# EAGLE design PDL (EAGLE 5.11)
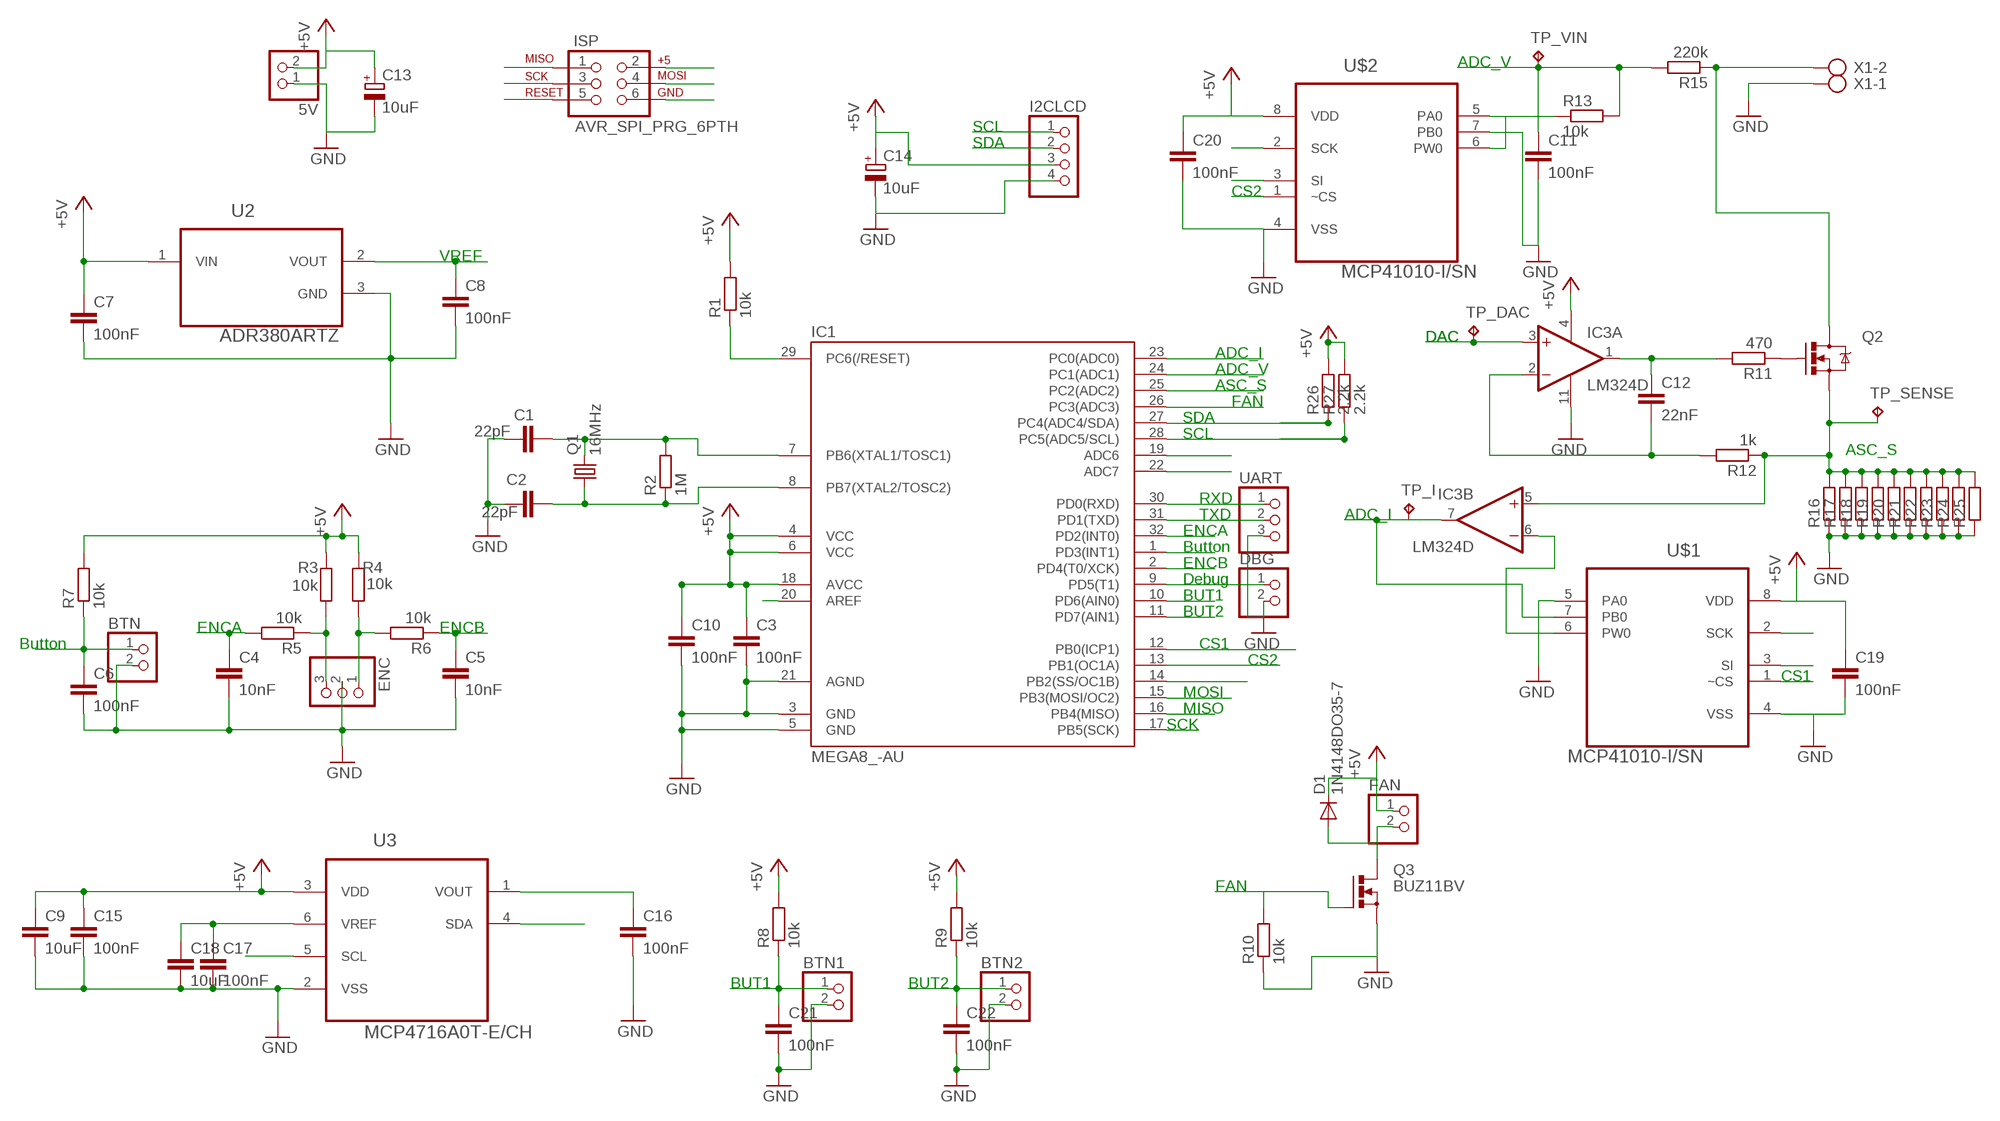
[diagram p0: schematic, sheet 1]

## Parts
5V  PINHD-1X2  [1X02]
BTN  PINHD-1X2  [1X02]
BTN1  PINHD-1X2  [1X02]
BTN2  PINHD-1X2  [1X02]
C1  22pF  C-EUC0805  [C0805]
C2  22pF  C-EUC0805  [C0805]
C3  100nF  C-EUC0805  [C0805]
C4  10nF  C-EUC0805  [C0805]
C5  10nF  C-EUC0805  [C0805]
C6  100nF  C-EUC0805  [C0805]
C7  100nF  C-EUC0805  [C0805]
C8  100nF  C-EUC0805  [C0805]
C9  10uF  C-EUC0805  [C0805]
C10  100nF  C-EUC0805  [C0805]
C11  100nF  C-EUC0805  [C0805]
C12  22nF  C-EUC0805  [C0805]
C13  10uF  CPOL-EU153CLV-0405  [153CLV-0405]
C14  10uF  CPOL-EU153CLV-0405  [153CLV-0405]
C15  100nF  C-EUC0805  [C0805]
C16  100nF  C-EUC0805  [C0805]
C17  100nF  C-EUC0805  [C0805]
C18  10uF  C-EUC0805  [C0805]
C19  100nF  C-EUC0805  [C0805]
C20  100nF  C-EUC0805  [C0805]
C21  100nF  C-EUC0805  [C0805]
C22  100nF  C-EUC0805  [C0805]
D1  1N4148DO35-7  [DO35-7]
DBG  PINHD-1X2  [1X02]
ENC  PINHD-1X3  [1X03]
FAN  PINHD-1X2  [1X02]
I2CLCD  PINHD-1X4  [1X04]
IC1  MEGA8_-AU  [TQFP32-08]
IC3  LM324D  [SO14]
ISP  AVR_SPI_PRG_6PTH  [2X3]
Q1  16MHz  CRYSTALHC49S  [HC49/S]
Q2  MOSFET-NCHANNELPTH2  [TO220V]
Q3  BUZ11BV  [TO220BV]
R1  10k  R-EU_R0805  [R0805]
R2  1M  R-EU_R0805  [R0805]
R3  10k  R-EU_R0805  [R0805]
R4  10k  R-EU_R0805  [R0805]
R5  10k  R-EU_R0805  [R0805]
R6  10k  R-EU_R0805  [R0805]
R7  10k  R-EU_R0805  [R0805]
R8  10k  R-EU_R0805  [R0805]
R9  10k  R-EU_R0805  [R0805]
R10  10k  R-EU_R0805  [R0805]
R11  470  R-EU_R0805  [R0805]
R12  1k  R-EU_R0805  [R0805]
R13  10k  R-EU_R0805  [R0805]
R15  220k  R-EU_R0805  [R0805]
R16  R-EU_0309/12  [0309/12]
R17  R-EU_0309/12  [0309/12]
R18  R-EU_0309/12  [0309/12]
R19  R-EU_0309/12  [0309/12]
R20  R-EU_0309/12  [0309/12]
R21  R-EU_0309/12  [0309/12]
R22  R-EU_0309/12  [0309/12]
R23  R-EU_0309/12  [0309/12]
R24  R-EU_0309/12  [0309/12]
R25  R-EU_0309/12  [0309/12]
R26  2.2k  R-EU_R0805  [R0805]
R27  2.2k  R-EU_R0805  [R0805]
TP_DAC  TPTP20SQ  [TP20SQ]
TP_I  TPTP20SQ  [TP20SQ]
TP_SENSE  TPTP20SQ  [TP20SQ]
TP_VIN  TPTP20SQ  [TP20SQ]
U2  ADR380ARTZ  [SOT95P237X112-3N]
U3  MCP4716A0T-E/CH  [SOT95P270X145-6N]
U$1  MCP41010-I/SN  [SOIC127P600X175-8N]
U$2  MCP41010-I/SN  [SOIC127P600X175-8N]
UART  PINHD-1X3  [1X03]
X1  AK500/2  [AK500/2]

## Nets
+5V: 5V.2 C3.1 C7.1 C9.1 C10.1 C13.+ C14.+ C15.1 C19.1 C20.1 D1.C FAN.1 I2CLCD.3 IC1.4(VCC) IC1.6(VCC) IC1.18(AVCC) IC3.4(P:V+) ISP.2 R1.2 R3.2 R4.2 R7.2 R8.2 R9.2 R26.2 R27.2 U2.1(VIN) U3.3(VDD) U$1.8(VDD) U$2.8(VDD)
ADC_I: IC1.23(PC0(ADC0)) IC3.7(B:OUT) TP_I.TP U$1.7(PB0)
ADC_S: IC1.25(PC2(ADC2)) IC3.5(B:+IN) Q2.3(S) R12.1 R16.2 R17.2 R18.2 R19.2 R20.2 R21.2 R22.2 R23.2 R24.2 R25.2 TP_SENSE.TP
ADC_V: C11.1 IC1.24(PC1(ADC1)) R13.2 R15.2 TP_VIN.TP
BTN: BTN.1 C6.1 IC1.1(PD3(INT1)) R7.1
BUT1: BTN1.1 C21.1 IC1.10(PD6(AIN0)) R8.1
BUT2: BTN2.1 C22.1 IC1.11(PD7(AIN1)) R9.1
CS1: IC1.12(PB0(ICP1)) U$1.1(~CS)
CS2: IC1.13(PB1(OC1A)) U$2.1(~CS)
DAC: C16.1 IC3.3(A:+IN) TP_DAC.TP U3.1(VOUT)
DAC_CS: IC1.14(PB2(SS/OC1B))
ENCA: C4.1 IC1.32(PD2(INT0)) R5.2
ENCB: C5.1 IC1.2(PD4(T0/XCK)) R6.1
FAN: IC1.26(PC3(ADC3)) Q3.G R10.2
GND: 5V.1 BTN1.2 BTN2.2 BTN.2 C1.2 C2.1 C3.2 C4.2 C5.2 C6.2 C7.2 C8.2 C9.2 C10.2 C11.2 C13.- C14.- C15.2 C16.2 C17.2 C18.2 C19.2 C20.2 C21.2 C22.2 DBG.2 ENC.2 I2CLCD.4 IC1.3(GND) IC1.5(GND) IC1.21(AGND) IC3.11(P:V-) ISP.6 Q3.S R10.1 R16.1 R17.1 R18.1 R19.1 R20.1 R21.1 R22.1 R23.1 R24.1 R25.1 U2.3(GND) U3.2(VSS) U$1.4(VSS) U$1.5(PA0) U$2.4(VSS) U$2.7(PB0) UART.3 X1.1
MISO: IC1.16(PB4(MISO)) ISP.1
MOSI: IC1.15(PB3(MOSI/OC2)) ISP.4 U$1.3(SI) U$2.3(SI)
N$1: C12.2 IC3.2(A:-IN) R12.2
N$2: C12.1 IC3.1(A:OUT) R11.2
N$3: ENC.3 R3.1 R5.1
N$4: Q2.2(D) R15.1 X1.2
N$6: R13.1 U$2.5(PA0) U$2.6(PW0)
N$7: IC3.6(B:-IN) U$1.6(PW0)
N$9: DBG.1 IC1.9(PD5(T1))
N$11: C1.1 IC1.7(PB6(XTAL1/TOSC1)) Q1.2 R2.2
N$12: C2.2 IC1.8(PB7(XTAL2/TOSC2)) Q1.1 R2.1
N$13: ENC.1 R4.1 R6.2
N$16: Q2.1(G) R11.1
N$18: IC1.30(PD0(RXD)) UART.1
N$19: IC1.31(PD1(TXD)) UART.2
N$20: IC1.19(ADC6)
N$21: IC1.22(ADC7)
N$23: D1.A FAN.2 Q3.D
RST: IC1.29(PC6(/RESET)) ISP.5 R1.1
SCK: IC1.17(PB5(SCK)) ISP.3 U$1.2(SCK) U$2.2(SCK)
SCL: I2CLCD.1 IC1.28(PC5(ADC5/SCL)) R27.1 U3.5(SCL)
SDA: I2CLCD.2 IC1.27(PC4(ADC4/SDA)) R26.1 U3.4(SDA)
VREF: C8.1 C17.1 C18.1 IC1.20(AREF) U2.2(VOUT) U3.6(VREF)
Unconnected: IC3.8(C:OUT) IC3.9(C:-IN) IC3.10(C:+IN) IC3.12(D:+IN) IC3.13(D:-IN) IC3.14(D:OUT)

## Notes on the sheet
- ADC_V
- SCL
- SDA
- CS2
- VREF
- DAC | DAC
- ADC_I
- ADC_V
- ASC_S
- FAN
- SDA
- SCL
- ASC_S
- RXD
- TXD | ADC_I
- ENCA
- Button
- ENCB
- Debug
- BUT1
- BUT2
- ENCA | ENCB
- Button | CS1
- CS2
- CS1
- MOSI
- MISO
- SCK
- FAN
- BUT1 | BUT2

## Library data of the parts
5V BTN BTN1 BTN2 DBG FAN = pinhead:PINHD-1X2: PIN HEADER
C1-C12 C15-C22 = rcl:C-EU: CAPACITOR, European symbol
C13 C14 = rcl:CPOL-EU: POLARIZED CAPACITOR, European symbol
D1 = diode:1N4148: DIODE high speed (Philips)
ENC UART = pinhead:PINHD-1X3: PIN HEADER
I2CLCD = pinhead:PINHD-1X4: PIN HEADER
IC1 = avr-7:MEGA8_
IC3 = linear:LM324: OP AMP
ISP = SparkFun:AVR_SPI_PRG_6: AVR ISP 6 Pin This is the reduced ISP connector for AVR programming. Common on Arduino. This footprint will take up less PCB space and can be used with a 10-pin to 6-pin adapter such as SKU: BOB-08508
Q1 = crystal:CRYSTAL: CRYSTAL; OC_FARNELL: 1667008; OC_NEWARK: unknown
Q2 = SparkFun:MOSFET-NCHANNEL
Q3 = transistor-power:BUZ11: N-CHANNEL MOS FET
R1-R13 R15-R27 = rcl:R-EU_: RESISTOR, European symbol
TP_DAC TP_I TP_SENSE TP_VIN = testpad:TP: Test pad
U2 = ADR380:ADR380ARTZ: IC Precision Low Drift 2.048 V/2.500 V SOT-23 Voltage Reference; MPN: ADR380ARTZ; OC_FARNELL: ADR380ARTZ; OC_NEWARK: 73T8170; PACKAGE: SOT-23-3; SUPPLIER: Analog Devices
U3 = MCP4716:MCP4716A0T-E/CH: Digital-to-Analog Converter,SOT23- 6; MPN: MCP4716A0T-E/CH; OC_FARNELL: 1925045; OC_NEWARK: 58T2010; PACKAGE: SOT23- 6; SUPPLIER: MICROCHIP
U$1 U$2 = MCP41xxx:MCP41010-I/SN: Digital potentiometer; DESCRIPTION: Digital potentiometer; MPN: MCP41010-I/SN; OC_FARNELL: 9758607; OC_NEWARK: 61K2949; PACKAGE: SOIC-8; SUPPLIER: Microchip
X1 = con-ptr500:AK500/2: CONNECTOR; OC_FARNELL: unknown; OC_NEWARK: unknown

## Board
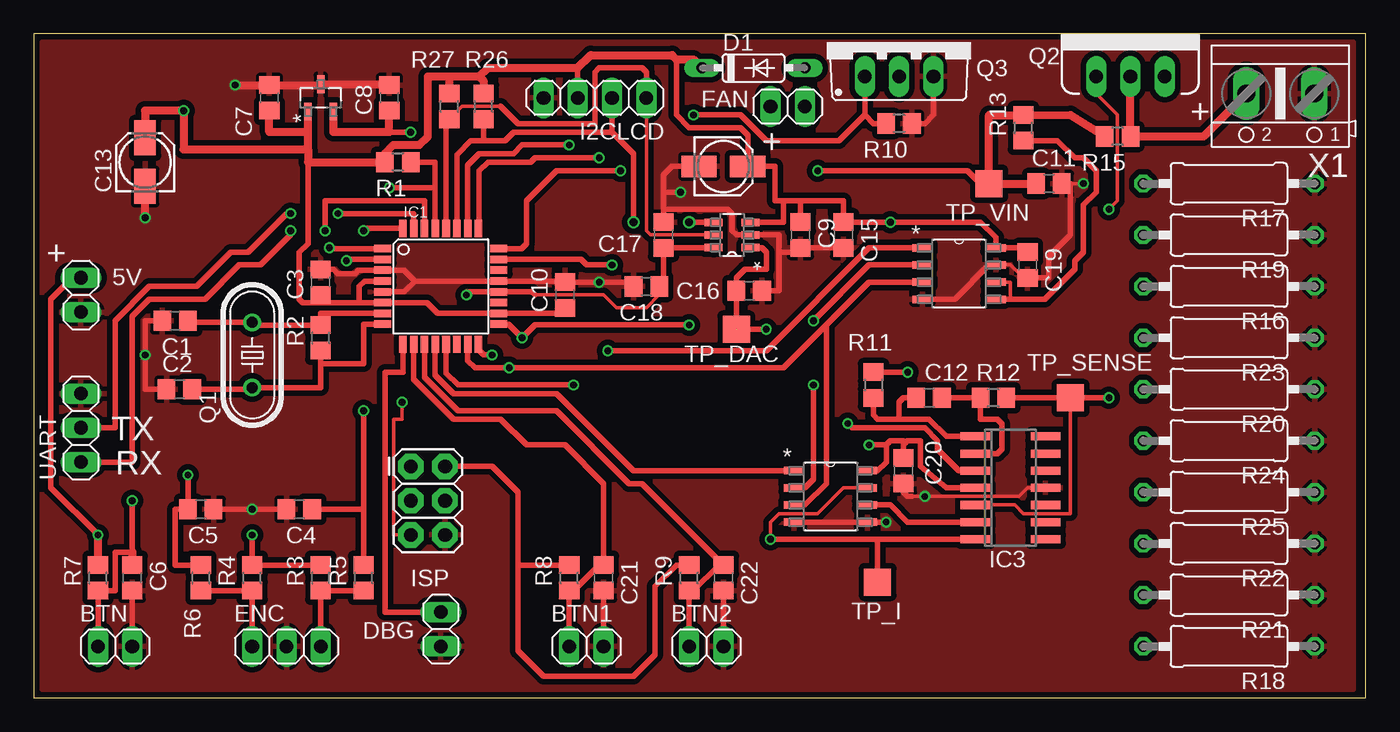
[diagram p1: board, top side]
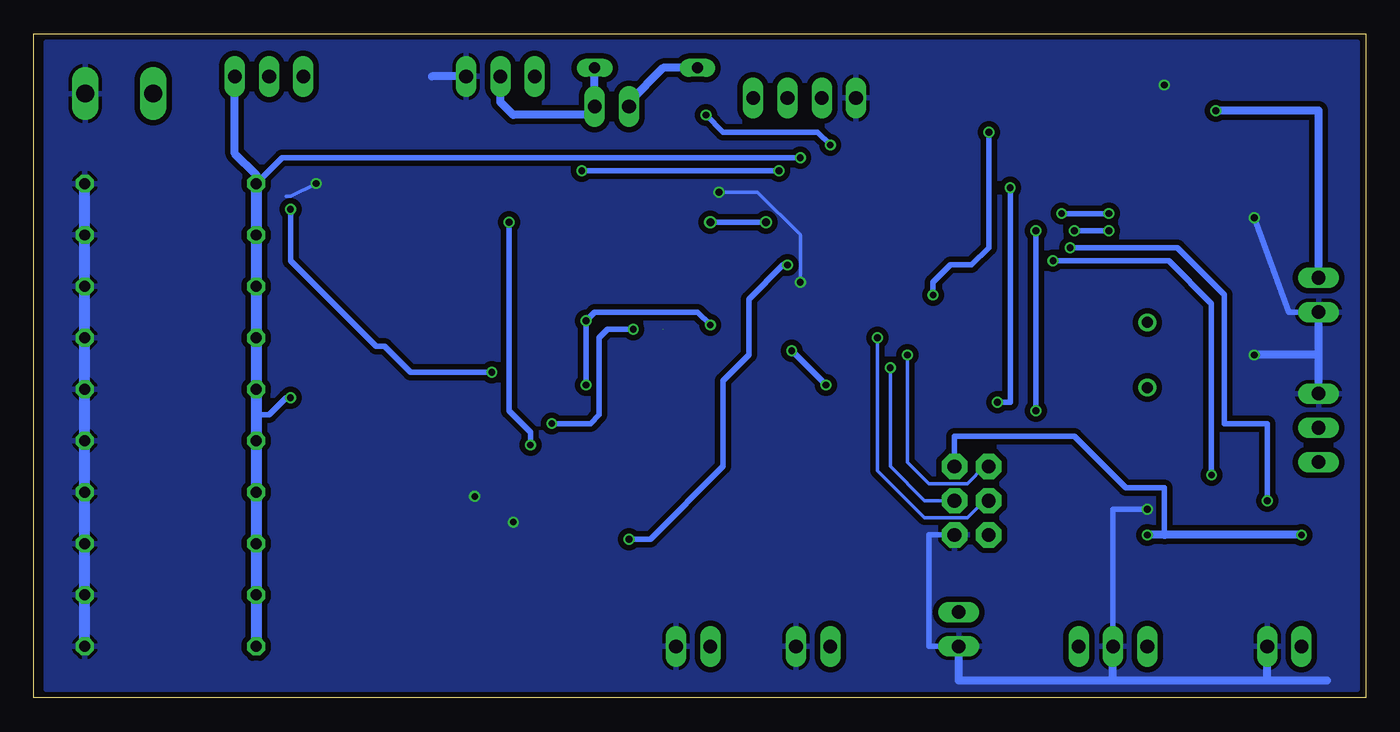
[diagram p2: board, bottom side, seen from below]

Size 98.72 x 49.2 mm. Coordinates in mm from the lower left corner, seen from the top.
Outline: 0,0 98.72,0 98.72,49.2 0,49.2 0,0
Copper layers (1*16): Top 0.035mm / dielectric 1.5mm / Bottom 0.035mm
Design rules "SeeedStudio_2layer_DRU_no_angle_20140221": minimum track width 6mil, minimum drill 12mil, track to track 6mil, track to pad 6mil, pad to pad 6mil, via to via 6mil, smd to smd 0mil, copper to edge 10mil, drill to drill 10mil, minimum pad ring 10mil, minimum via ring 6mil, stop-mask expansion 2mil, vias tented up to drill 100mil, thermal gap 10mil

### Footprints (pad centres in the part's own frame; a part is rotated, then mirrored left to right if it is on the bottom)
1X02 = drill 1.016 long: 1 -1.27,0; 2 1.27,0
C0805 = smd 1.3 x 1.5: 1 -0.95,0; 2 0.95,0
153CLV-0405 = smd 2.6 x 1.6: + 1.8,0; - -1.8,0
DO35-7 = drill 0.813 long: A 3.81,0; C -3.81,0
1X03 = drill 1.016 long: 1 -2.54,0; 2 0,0; 3 2.54,0
1X04 = drill 1.016 long: 1 -3.81,0; 2 -1.27,0; 3 1.27,0; 4 3.81,0
TQFP32-08 = smd 1.27 x 0.559: 1 -4.293,2.8; 2 -4.293,2; 3 -4.293,1.2; 4 -4.293,0.4; 5 -4.293,-0.4; 6 -4.293,-1.2; 7 -4.293,-2; 8 -4.293,-2.8; 17 4.293,-2.8; 18 4.293,-2; 19 4.293,-1.2; 20 4.293,-0.4; 21 4.293,0.4; 22 4.293,1.2; 23 4.293,2; 24 4.293,2.8 | smd 0.559 x 1.27: 9 -2.8,-4.293; 10 -2,-4.293; 11 -1.2,-4.293; 12 -0.4,-4.293; 13 0.4,-4.293; 14 1.2,-4.293; 15 2,-4.293; 16 2.8,-4.293; 25 2.8,4.293; 26 2,4.293; 27 1.2,4.293; 28 0.4,4.293; 29 -0.4,4.293; 30 -1.2,4.293; 31 -2,4.293; 32 -2.8,4.293
SO14 = smd 0.6 x 2.2: 1 -3.81,-2.6; 2 -2.54,-2.6; 3 -1.27,-2.6; 4 0,-2.6; 5 1.27,-2.6; 6 2.54,-2.6; 7 3.81,-2.6; 8 3.81,2.6; 9 2.54,2.6; 10 1.27,2.6; 11 0,2.6; 12 -1.27,2.6; 13 -2.54,2.6; 14 -3.81,2.6
2X3 = drill 1.016 pad 1.88 octagon: 1 0,0; 2 0,2.54; 3 2.54,0; 4 2.54,2.54; 5 5.08,0; 6 5.08,2.54
HC49/S = drill 0.813 round: 1 -2.413,0; 2 2.413,0
TO220V = drill 1.016 long: 1 -2.54,0; 2 0,0; 3 2.54,0
TO220BV = drill 1.016 long: D 0,-2.54; G -2.54,-2.54; S 2.54,-2.54
R0805 = smd 1.3 x 1.5: 1 -0.95,0; 2 0.95,0
0309/12 = drill 0.813 octagon: 1 -6.35,0; 2 6.35,0
TP20SQ = smd 2 x 2: TP 0,0
SOT95P237X112-3N = smd 1.321 x 0.559: 1 -1.016,0.94; 2 -1.016,-0.94; 3 1.016,0
SOT95P270X145-6N = smd 1.321 x 0.559: 1 -1.372,0.94; 2 -1.372,0; 3 -1.372,-0.94; 4 1.372,-0.94; 5 1.372,0; 6 1.372,0.94
SOIC127P600X175-8N = smd 1.473 x 0.559: 1 -2.718,1.905; 2 -2.718,0.635; 3 -2.718,-0.635; 4 -2.718,-1.905; 5 2.718,-1.905; 6 2.718,-0.635; 7 2.718,0.635; 8 2.718,1.905
AK500/2 = drill 1.321 long: 1 -2.515,0; 2 2.515,0

### Placement (x,y rotation side)
5V  3.49,29.84 90 top
BTN  6.03,3.81 0 top
BTN1  40.96,3.81 0 top
BTN2  49.85,3.81 0 top
C1  10.48,27.94 180 top
C2  10.79,22.86 0 top
C3  21.27,30.8 90 top
C4  19.69,13.97 180 top
C5  12.38,13.97 0 top
C6  7.3,8.89 270 top
C7  17.46,44.45 90 top
C8  26.35,44.45 90 top
C9  56.83,34.29 270 top
C10  39.37,29.84 90 top
C11  75.25,38.1 0 top
C12  66.36,22.23 0 top
C13  8.25,39.69 90 top
C14  51.12,39.37 0 top
C15  60.01,34.29 270 top
C16  53.02,30.16 0 top
C17  46.67,34.29 90 top
C18  45.4,30.48 180 top
C19  73.66,32.07 270 top
C20  64.45,16.83 270 top
C21  42.23,8.89 270 top
C22  51.12,8.89 270 top
D1  53.34,46.67 0 top
DBG  30.16,5.08 270 top
ENC  18.73,3.81 0 top
FAN  55.88,43.81 0 top
I2CLCD  41.59,44.45 180 top
IC1  30.16,30.48 0 top
IC3  72.39,15.56 270 top
ISP  27.94,17.14 270 top
Q1  16.19,25.4 90 top
Q2  81.28,46.04 0 top
Q3  64.14,48.58 0 top
R1  26.99,39.69 180 top
R2  21.27,26.67 90 top
R3  21.27,8.89 90 top
R4  16.19,8.89 90 top
R5  24.45,8.89 90 top
R6  12.38,8.89 270 top
R7  4.76,8.89 90 top
R8  39.69,8.89 90 top
R9  48.58,8.89 90 top
R10  64.14,42.55 180 top
R11  62.23,23.18 270 top
R12  71.12,22.23 180 top
R13  73.34,42.23 90 top
R15  80.33,41.59 180 top
R16  88.58,30.48 180 top
R17  88.58,38.1 180 top
R18  88.58,3.81 180 top
R19  88.58,34.29 180 top
R20  88.58,22.86 180 top
R21  88.58,7.62 180 top
R22  88.58,11.43 180 top
R23  88.58,26.67 180 top
R24  88.58,19.05 180 top
R25  88.58,15.24 180 top
R26  33.34,43.81 90 top
R27  30.8,43.81 90 top
TP_DAC  52.07,27.3 0 top
TP_I  62.55,8.57 0 top
TP_SENSE  76.84,22.23 0 top
TP_VIN  70.8,38.1 0 top
U2  21.27,44.45 90 top
U3  51.75,34.29 180 top
U$1  59.05,14.92 0 top
U$2  68.58,31.43 0 top
UART  3.49,20 90 top
X1  92.39,44.77 180 top

### Tracks (layer width: path | path; a pad name or v marks a point on that pad's centre or on a via)
+5V  (via drill 0.5)
  Top 0.406: U3.3 55.56,35.23 55.56,36.83 | 55.56,36.83 56.83,36.83 | 56.83,36.83 60.01,36.83 C15.1 v63.5,35.24 70.17,35.24 71.3,34.11 U$2.8 73.34,33.34 C19.1 | 56.83,36.83 C9.1 | R3.2 R4.2 v16.19,12.06 | 55.56,36.83 54.93,36.83 54.93,39.37 C14.+ 52.92,41.7 52.39,42.23 48.58,42.23 47.63,43.18 47.63,47.31 | C10.1 38.96,28.48 IC1.18 29.94,28.48 29.14,29.28 IC1.6 24.13,29.28 | R1.2 26.04,40.33 | 40.32,46.67 I2CLCD.3 | U$1.8 62.55,16.83 63.18,17.46 63.18,18.73 | 63.18,18.73 63.5,19.05 64.45,19.05 64.45,18.73 | 64.45,18.73 C20.1 | IC3.4 67.63,15.56 65.72,17.14 65.72,19.05 64.77,19.05 64.45,18.73 | R9.2 47.62,9.84 46.04,8.26 46.04,3.17 44.45,1.59 37.78,1.59 35.88,3.49 35.88,9.84 | 35.88,9.84 35.88,15.24 33.97,17.14 ISP.2 | R8.2 35.88,9.84 | 21.84,29.28 24.13,29.28 | 21.84,29.28 C3.1 | IC1.4 24.53,30.88 24.13,30.48 24.13,29.28 | 21.84,29.28 19.93,29.28 19.69,29.53 19.69,33.02 20.32,33.66 20.32,39.67 20.33,39.69 | 5V.2 2.86,31.11 1.27,29.53 1.27,15.56 v4.76,12.06 | v61.91,18.73 63.18,18.73
  Top 0.61: C7.1 17.46,41.91 20.33,41.91 | 20.33,41.91 U2.1 | C13.+ 8.25,43.5 v11.11,43.5 11.11,40.64 20.33,40.64 | 20.33,40.64 20.33,41.91 | R7.2 v4.76,12.06 | 20.33,40.64 20.33,39.69 R1.2 | 26.04,40.33 26.67,40.96 28.57,40.96 29.21,41.59 29.21,46.04 30.8,46.04 | 30.8,46.04 R27.2 | R26.2 33.34,45.72 33.02,46.04 | 30.8,46.04 33.02,46.04 | 33.02,46.04 33.65,46.67 40.32,46.67 41.28,47.62 47.31,47.62 47.63,47.31 48.89,47.31 D1.C
  Bottom 0.406: ISP.2 30.48,19.37 21.59,19.37 17.78,15.56 14.92,15.56 14.92,12.06 | v61.91,18.73 61.91,19.68 63.5,21.27 v63.5,35.24
  Bottom 0.61: 5V.2 3.49,43.5 v11.11,43.5 | v4.76,12.06 14.92,12.06 v16.19,12.06 | FAN.1 54.61,44.13 52.07,46.67 D1.C
ADC_I  (via drill 0.5)
  Top 0.254: U$1.7 60.01,15.56 58.1,13.65 55.24,13.65 54.61,13.02 v54.61,11.75
  Top 0.406: 62.55,11.75 IC3.7 | IC1.23 40.54,32.48 40.96,32.07 v42.86,32.07 | 62.55,11.75 TP_I.TP | 62.55,11.75 v54.61,11.75
  Bottom 0.406: v42.86,32.07 43.18,32.07 45.72,29.53 45.72,25.4 47.63,23.5 47.63,17.14 53.02,11.75 v54.61,11.75
ADC_S  (via drill 0.5)
  Top 0.254: IC3.5 72.71,14.29 73.34,13.65 76.84,13.65 TP_SENSE.TP
  Top 0.406: IC1.25 33.02,34.77 33.02,39.05 33.65,39.69 36.83,39.69 37.15,40.01 v41.91,40.01 | R12.1 TP_SENSE.TP v79.69,22.23
  Bottom 0.406: v79.69,22.23 80.01,22.23 81.28,20.95 82.23,20.95 | v41.91,40.01 80.33,40.01 R17.2
  Bottom 0.61: R17.2 82.23,38.73 83.82,40.32 Q2.3
  Bottom 0.813: R17.2 R19.2 R16.2 R23.2 R20.2 82.23,20.95 R24.2 R25.2 R22.2 R21.2 R18.2
ADC_V  (via drill 0.5)
  Top 0.406: TP_VIN.TP 70.17,38.1 69.21,39.05 v58.1,39.05 | IC1.24 36.14,33.28 36.51,33.66 36.51,36.83 38.74,39.05 v43.5,39.05
  Top 0.61: R15.2 76.84,43.18 R13.2 70.8,43.18 TP_VIN.TP C11.1
  Bottom 0.406: v43.5,39.05 v58.1,39.05
BTN  (via drill 0.5)
  Top 0.406: 7.3,10.79 6.03,10.79 6.03,7.94 R7.1 BTN.1 | C6.1 v7.3,14.61 | IC1.1 21.91,33.28 v21.91,33.34
  Top 0.61: 7.3,10.79 C6.1
  Bottom 0.406: v7.3,14.61 7.3,20.32 10.48,20.32 10.48,29.84 13.97,33.34 v21.91,33.34
BUT1
  Top 0.406: IC1.10 28.16,23.59 31.12,20.64 34.61,20.64 36.51,18.73 39.37,18.73 42.23,15.88 C21.1 41.91,9.53 41.59,9.53 40.01,7.94 R8.1 BTN1.1
BUT2
  Top 0.406: R9.1 | BTN2.1 R9.1 | IC1.11 28.96,23.74 31.43,21.27 38.74,21.27 44.13,15.88 45.08,15.88 C22.1 50.8,9.53 50.48,9.53 49.21,8.26 48.89,8.26 R9.1
CS1
  Top 0.406: IC1.12 29.76,23.89 31.12,22.54 38.74,22.54 44.45,16.83 U$1.1
CS2  (via drill 0.5)
  Top 0.406: IC1.13 30.56,24.05 31.43,23.18 v40,23.18 | U$2.1 61.91,33.34 54.29,25.72 v42.54,25.72
  Bottom 0.406: v40,23.18 v42.54,25.72
DAC  (via drill 0.5)  (1 unrouted)
  Top 0.406: IC3.3 68.58,16.83 66.99,18.41 66.99,19.05 66.04,20 60.64,20 v60.32,20.32 | U3.1 53.96,33.35 54.29,33.02 54.29,31.75 52.71,31.75 52.07,31.11 C16.1 TP_DAC.TP | TP_DAC.TP v54.29,27.3
  Bottom 0.406: v60.32,20.32 57.47,20.32 56.83,20.95 56.83,26.67 56.2,27.3 v54.29,27.3
ENCA  (via drill 0.5)
  Top 0.406: R5.2 24.45,13.97 | 24.45,13.97 C4.1 | IC1.32 24.45,34.77 v24.45,34.61 | 24.45,13.97 v24.45,21.27
  Bottom 0.406: v24.45,21.27 v24.45,34.61
ENCB  (via drill 0.5)
  Top 0.406: R6.1 10.48,9.84 10.48,13.97 C5.1 v11.43,16.51 | IC1.2 23.18,32.48 v23.18,32.38
  Bottom 0.406: v23.18,32.38 14.6,32.38 11.43,29.21 v11.43,16.51
FAN  (via drill 0.5)
  Top 0.406: 61.6,43.18 Q3.G | 61.6,43.18 62.23,42.55 R10.2 | v39.69,40.96 36.2,40.96 35.56,40.32 33.02,40.32 32.16,39.47 IC1.26 | v48.89,43.18 52.39,43.18 54.29,41.27 59.69,41.27 61.6,43.18
  Bottom 0.406: v48.89,43.18 47.63,41.91 40.64,41.91 v39.69,40.96
GND  (via drill 0.5)
  Top 0.254: IC3.11 73.66,15.56 73.03,14.92 v66.04,14.92 65.09,14.92 | 44.14,30.8 v41.91,30.8 | C11.2 v77.79,38.1 | C19.2 73.34,31.12 72.39,32.07 U$2.7
  Top 0.406: 55.24,33.02 55.24,34.29 U3.2 52.07,34.29 51.75,34.61 51.75,35.88 51.43,36.2 46.67,36.2 | 55.24,33.02 56.83,33.02 C9.2 C15.2 | C4.2 v16.19,13.97 C5.2 | BTN.2 C6.2 | C1.2 8.25,27.94 v8.25,25.4 8.25,22.86 C2.1 | 28.26,30.88 IC1.21 39.28,30.88 C10.2 44.14,30.8 C18.2 | 55.24,33.02 55.24,30.16 C16.2 | C14.- 47.31,39.37 46.67,38.73 46.67,37.47 | 46.67,37.47 46.67,36.2 | C19.2 75.24,31.12 75.25,31.11 75.25,32.7 76.84,34.29 76.84,38.1 C11.2 | U$2.4 68.26,29.53 70.8,32.07 U$2.7 | 46.67,36.2 C17.2 | v47.94,37.47 46.67,37.47 | Q3.S 66.68,43.18 66.04,42.55 R10.1 | BTN1.2 C21.2 | BTN2.2 C22.2 | C3.2 22.22,31.75 | 22.22,31.75 22.23,31.75 | 22.22,31.75 22.54,31.43 23.81,31.43 24.06,31.68 IC1.3 27.46,31.68 28.26,30.88 | IC1.5 27.46,30.08 28.26,30.88 | v63.18,13.02 U$1.5 U$1.4 | 65.09,14.92 64.77,14.92 64.45,15.24 C20.2
  Top 0.61: C8.2 26.35,45.47 U2.3 21.27,45.4 C7.2 v14.92,45.4 | v8.25,35.56 C13.-
  Bottom 0.254: v47.94,37.47 45.09,37.47 41.91,34.29 v41.91,30.8 | 80.01,37.15 79.69,37.15 v77.79,38.1
  Bottom 0.406: v16.19,13.97 C4.2 ENC.2 | ISP.6 32.39,12.06 32.39,3.81 DBG.2 | 5V.1 5.71,28.57 v8.25,35.56
  Bottom 0.61: 7.3,1.27 BTN.2 | 7.3,1.27 18.73,1.27 | 18.73,1.27 ENC.2 | DBG.2 30.16,1.27 18.73,1.27 | 3.49,22.23 3.49,25.4 | 2.86,1.27 7.3,1.27 | 3.49,25.4 5V.1 | 3.49,25.4 v8.25,25.4 | Q3.S 69.21,46.04
  Bottom 0.813: R18.1 R21.1 R22.1 R25.1 R24.1 R20.1 R23.1 R16.1 R19.1 R17.1
  pour Bottom (isolate 0.406): 0.64,48.58 97.79,48.58 97.79,0.64 0.64,0.64
  pour Top (isolate 0.406): 0.64,48.26 0.64,0.64 97.79,0.64 97.79,48.58 0.64,48.58
MISO  (via drill 0.5)
  Top 0.406: IC1.16 32.96,25.77 33.34,25.4 v33.97,25.4
  Bottom 0.254: ISP.1 28.26,17.14 29.53,15.88 32.39,15.88 33.97,17.46 v33.97,25.4
MOSI  (via drill 0.5)
  Top 0.406: IC1.15 32.16,24.99 32.7,24.45 v35.24,24.45 55.56,24.45 58.74,27.62 | 58.74,27.62 61.91,30.8 U$2.3 | U$1.3 57.15,14.29 58.74,15.88 58.74,27.62
  Bottom 0.254: ISP.4 32.7,14.61 35.24,17.14 v35.24,24.45
N$1
  Top 0.406: C12.2 R12.2 70.17,20.64 71.44,20.64 71.76,20.32 71.76,18.41 71.44,18.1 IC3.2
N$2
  Top 0.406: R11.2 62.23,20.95 62.55,20.64 64.14,20.64 | 64.14,20.64 66.36,20.64 67.63,19.37 IC3.1 | C12.1 64.45,22.23 64.14,21.91 64.14,20.64
N$3
  Top 0.406: ENC.3 R3.1 R5.1
N$4
  Top 0.61: Q2.2 81.28,45.72 R15.1 86.7,41.59 X1.2
N$6
  Top 0.254: U$2.6 72.39,30.8 72.39,29.53
  Top 0.406: R13.1 74.61,41.27 75.88,41.27 77.15,40.01 77.79,40.01 78.74,39.05 78.74,37.47 77.79,36.51 77.79,33.02 77.15,32.38 77.15,31.75 74.93,29.53 72.39,29.53 U$2.5
N$7
  Top 0.406: U$1.6 63.5,14.29 64.77,13.02 IC3.6
N$9
  Top 0.406: IC1.9 27.36,24.13 26.03,24.13 26.03,6.35 DBG.1
N$11
  Top 0.406: IC1.7 21.27,28.48 R2.2 16.19,27.62 Q1.2 11.74,27.81 C1.1
N$12
  Top 0.406: IC1.8 24.45,27.68 24.45,24.77 21.27,24.77 | 21.27,24.77 R2.1 | C2.2 16.19,22.86 Q1.1 21.27,22.99 21.27,24.77
N$13
  Top 0.406: R6.2 R4.1 ENC.1
N$16  (via drill 0.5)
  Top 0.254: Q2.1 78.74,44.77 80.33,43.18 80.33,36.83 v79.69,36.2 | R11.1
  Top 0.406: R11.1 v64.77,24.13
  Bottom 0.406: v79.69,36.2 79.69,32.38 73.34,26.04 72.71,26.04 70.8,24.13 v64.77,24.13
N$18  (via drill 0.5)
  Top 0.406: IC1.30 28.96,36.83 21.59,36.83 v21.59,34.61 | UART.1 7.3,17.46 7.3,28.26 8.57,29.53 12.7,29.53 15.24,32.07 16.83,32.07 19.05,34.29 v19.05,34.61
  Bottom 0.406: v19.05,34.61 v21.59,34.61
N$19  (via drill 0.5, 0.5 pad 0.25)
  Top 0.406: IC1.31 28.16,35.88 v22.54,35.88 | UART.2 6.03,20 6.03,27.94 8.57,30.48 12.07,30.48 14.6,33.02 15.87,33.02 18.73,35.88 v19.05,35.88
  Bottom 0.406: v19.05,35.88 v22.54,35.88
N$23
  Bottom 0.61: Q3.D 64.14,44.13 63.18,43.18 57.78,43.18 FAN.2 D1.A
RST  (via drill 0.5)
  Top 0.254: ISP.5 26.67,12.06 26.67,20.64 27.3,20.64 v27.3,21.91
  Top 0.406: 29.76,37.78 IC1.29 | v26.35,37.78 29.76,37.78 | 29.76,37.78 29.76,39.69 R1.1
  Bottom 0.406: v27.3,21.91 26.35,21.91 v26.35,37.78
SCK  (via drill 0.5)
  Top 0.406: U$1.2 57.15,15.56 57.78,16.19 v57.78,23.18 | U$2.2 61.91,32.07 v57.78,27.94 | 48.52,27.68 v48.58,27.62 37.15,27.62 v36.2,26.67 35.18,27.68 IC1.17
  Bottom 0.254: ISP.3 28.26,14.61 29.53,13.34 32.7,13.34 36.2,16.83 v36.2,26.67
  Bottom 0.406: v57.78,23.18 v57.78,27.94 57.15,28.57 49.53,28.57 v48.58,27.62
SCL
  Top 0.254: 34.61,43.81 31.75,43.81 R27.1 | I2CLCD.1 45.4,34.61 45.72,34.29 U3.5
  Top 0.406: IC1.28 30.56,42.63 R27.1 | I2CLCD.1 45.4,46.35 45.09,46.67 41.91,46.67 41.59,46.35 41.59,42.55 35.88,42.55 34.61,43.81
SDA  (via drill 0.6)
  Top 0.406: 42.86,41.91 I2CLCD.2 | 42.86,41.91 44.45,40.32 v44.45,35.24 | U3.4 v48.59,35.23 v48.58,35.24 | 42.86,41.91 35.56,41.91 34.92,41.27 33.34,41.27 | 33.34,41.27 32.39,41.27 31.36,40.25 IC1.27 | 33.34,41.27 R26.1
  Bottom 0.406: v44.45,35.24 v48.58,35.24
VREF  (via drill 0.5)
  Top 0.254: 37.15,29.84 42.23,29.84 43.18,28.89 45.4,28.89 46.35,29.84 C18.1
  Top 0.406: U3.6 C17.1 46.67,30.48 | v32.07,29.84 32.07,30.08 IC1.20 36.91,30.08 37.15,29.84 | v27.94,41.91 26.35,41.91
  Top 0.61: U3.6 | C18.1 46.67,30.48 | C8.1 26.35,41.91 22.21,41.91 U2.2
  Bottom 0.406: v32.07,29.84 32.07,30.8 30.8,32.07 29.21,32.07 27.94,33.34 v27.94,41.91

### Text on the board
tNames: + | + | + | TX | RX